# Altium schematic sheet Screen Driver.SchDoc: Graphics Driver PCB (part 2 of 3)
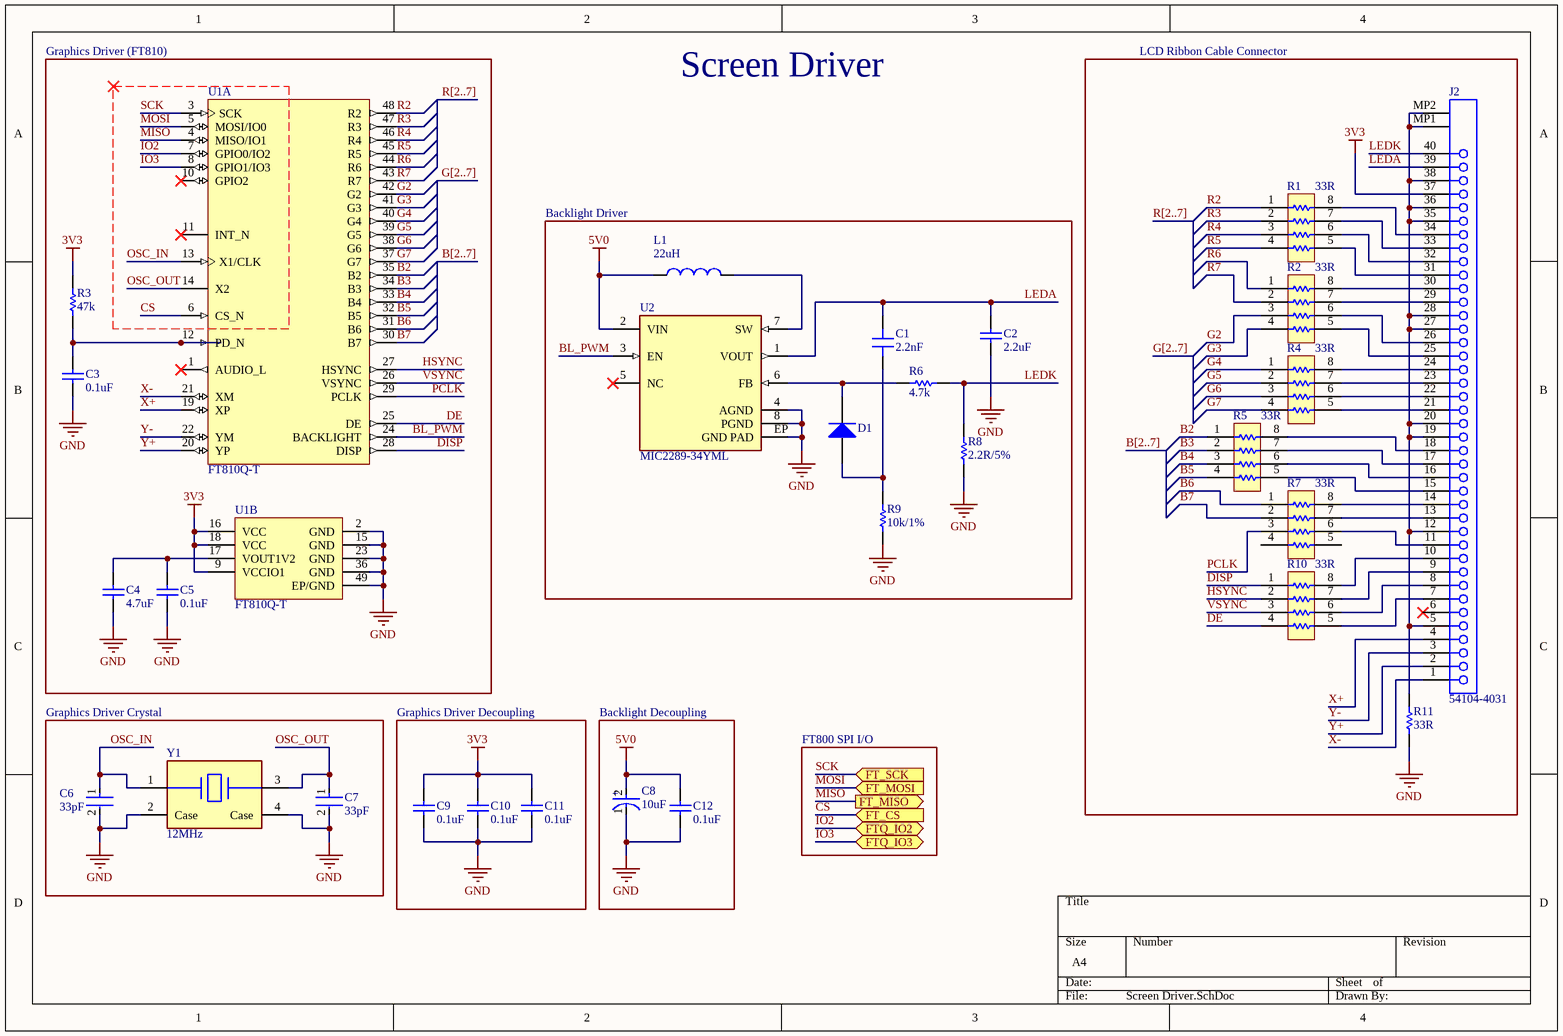
[diagram p1: Screen Driver.SchDoc]
## Library data of the parts
C1 = Capacitor - Ceramic: CAP CER 2200PF 50V X7R 0805; Manufacturer: Samsung; Manufacturer Part Number: CL21B222KBANNNC; Tolerance: 10%; Value: 2.2nF; Supplier 1: LCSC; Supplier Part Number 1: C1728; RoHS: Yes; Category: Ceramic Capacitors; Stock 1: 34350; Pricing 1: 50=0.01170, 500=0.00870, 1500=0.00810, 5000=0.00760, 25000=0.00730, 50000=0.00720, 50=0.01120, 500=0.00830, 1500=0.00770, 5000=0.00720, 25000=0.00700, 50000=0.00690, 50=0.05700, 500=0.04220, 1500=0.03940, 5000=0.03670, 25000=0.03550, 50000=0.03490, 50=0.05300, 500=0.03920, 1500=0.03670, 5000=0.03420, 25000=0.03300, 50000=0.03250, 50=0.00710, 500=0.00530, 1500=0.00490, 5000=0.00460, 25000=0.00440, 50000=0.00440, 50=0.00650, 500=0.00480, 1500=0.00450, 5000=0.00420, 25000=0.00410, 50000=0.00400, 50=0.06480, 500=0.04800, 1500=0.04490, 5000=0.04180, 25000=0.04040, 50000=0.03970, 50=0.88400, 500=0.65400, 1500=0.61170, 5000=0.56950, 25000=0.55080, 50000=0.54150, 50=0.03480, 500=0.02570, 1500=0.02410, 5000=0.02240, 25000=0.02170, 50000=0.02130, 50=0.65980, 500=0.48810, 1500=0.45660, 5000=0.42500, 25000=0.41110, 50000=0.40410, 50=0.07500, 500=0.05550, 1500=0.05190, 5000=0.04830, 25000=0.04670, 50000=0.04590, 50=0.01140, 500=0.00850, 1500=0.00790, 5000=0.00740, 25000=0.00710, 50000=0.00700, 50=0.00836, 500=0.00619, 1500=0.00579, 5000=0.00539, 25000=0.00521, 50000=0.00512 (AUD); Mount: Surface Mount; Case/Package: 0805; Case Code (Imperial): 0805; Case Code (Metric): 2012; Contact Plating: Tin; Material: Ceramic; Min Operating Temperature: -55°C; Max Operating Temperature: 125°C; Dielectric: X7R; Packaging: Tape and Reel; Capacitance: 2.2nF; Voltage Rating: 50V; Package Quantity: 1; Voltage: 50V; Length: 2mm; Height: 0.65mm; Depth: 1.25mm; Width: 0.049inch; Thickness: 0.03inch; Radiation Hardening: No; ComponentLink1URL: https://datasheet.ciiva.com/26838/getdatasheetpartid-640852-26838689.pdf?src-supplier=Verical; ComponentLink1Description: https://datasheet.ciiva.com/26838/getdatasheetpartid-640852-26838689.pdf?src-supplier=Verical; ComponentLink2URL: https://datasheet.ciiva.com/25802/cl21b222kbannnc-25802100.pdf?src-supplier=Digi-Key; ComponentLink2Description: https://datasheet.ciiva.com/25802/cl21b222kbannnc-25802100.pdf?src-supplier=Digi-Key; ComponentLink3URL: https://datasheet.ciiva.com/29199/455716-da-01-en-vs-kondensator-0805-29199282.pdf?src-supplier=Conrad; ComponentLink3Description: https://datasheet.ciiva.com/29199/455716-da-01-en-vs-kondensator-0805-29199282.pdf?src-supplier=Conrad; ComponentLink4URL: https://datasheet.ciiva.com/16199/cl05b104kq5nnnc-16199209.pdf?src-supplier=Future+Electronics; ComponentLink4Description: https://datasheet.ciiva.com/16199/cl05b104kq5nnnc-16199209.pdf?src-supplier=Future+Electronics; Supplier 2: Digi-Key; Supplier Part Number 2: 1276-1171-1-ND; Stock 2: 368698; Pricing 2: 1=0.10000, 10=0.04500, 50=0.02440, 100=0.01990, 500=0.01424, 1000=0.01119 (USD)
C2 = CMP-1662-00021-1: Chip Capacitor, 22 uF, +/- 10%, 25 V, -55 to 125 degC, 1210 (3225 Metric), RoHS, Tape and Reel; Manufacturer: Murata; Manufacturer Part Number: GRM32ER71E226KE15L; Current Rating: 3 A; Colour: Black; Gender: Male; Material: Ceramic; Capacitance: 22uF; Voltage Rating: 25V; Dielectric: X7R; Contact Plating: Gold; PackageDescription: 2-Pin Surface Mount Device, Body 3.2 x 2.5 mm; Package Quantity: 100; Height: 8.13 mm; Pins: 40; Mount: Through Hole; ComponentLink1URL: http://www.murata.com/; RoHSCompliant: True; Packaging: Tray; ComponentLink2URL: https://datasheet.ciiva.com/3776/2741grm32er71e226ke1523-3776996.pdf; Width: 2.34 mm; Radiation Hardening: No; Lead Pitch: 2.54 mm; Min Operating Temperature: -65degC; Contact Finish: Gold; REACH SVHC: Unknown; Max Operating Temperature: 105degC; DatasheetVersion: Aug-14; Length: 101.19 mm; Contact Material: Bronze; ComponentLink2Description: Datasheet; ComponentLink1Description: Manufacturer URL; PackageReference: 1210; Supplier 1: LCSC; Supplier Part Number 1: C21397; RoHS: Yes; Category: Ceramic Capacitors; Stock 1: 95358; Pricing 1: 1=0.29290, 10=0.21340, 30=0.19880, 100=0.18420, 500=0.17770, 1000=0.17450, 1=0.27960, 10=0.20380, 30=0.18980, 100=0.17590, 500=0.16970, 1000=0.16660, 1=1.42360, 10=1.03740, 30=0.96640, 100=0.89540, 500=0.86400, 1000=0.84830, 1=1.32480, 10=0.96540, 30=0.89940, 100=0.83330, 500=0.80400, 1000=0.78950, 1=0.17790, 10=0.12970, 30=0.12080, 100=0.11190, 500=0.10800, 1000=0.10600, 1=0.16240, 10=0.11840, 30=0.11030, 100=0.10220, 500=0.09860, 1000=0.09680, 1=1.61930, 10=1.18000, 30=1.09920, 100=1.01850, 500=0.98270, 1000=0.96490, 1=22.08220, 10=16.09130, 30=14.99040, 100=13.88950, 500=13.40150, 1000=13.15840, 1=0.86840, 10=0.63280, 30=0.58950, 100=0.54620, 500=0.52700, 1000=0.51750, 1=16.48090, 10=12.00970, 30=11.18800, 100=10.36640, 500=10.00220, 1000=9.82070, 1=1.87250, 10=1.36450, 30=1.27110, 100=1.17780, 500=1.13640, 1000=1.11580, 1=0.28580, 10=0.20830, 30=0.19400, 100=0.17980, 500=0.17340, 1000=0.17030, 1=0.20893, 10=0.15225, 30=0.14183, 100=0.13142, 500=0.12680, 1000=0.12450 (AUD); Case/Package: 1210; Number of Pins: 2; Case Code (Metric): 3225; Case Code (Imperial): 1210; Tolerance: 10%; Voltage Rating (DC): 25V; Termination: SMD/SMT; Voltage: 25V; Depth: 2.5mm; Thickness: 0.106inch; Lead Free: Lead Free; ComponentLink3URL: https://datasheet.ciiva.com/6072/1697714-6072768.pdf?src-supplier=Farnell; ComponentLink3Description: https://datasheet.ciiva.com/6072/1697714-6072768.pdf?src-supplier=Farnell; ComponentLink4URL: https://datasheet.ciiva.com/16497/product-16497009.pdf?src-supplier=Future+Electronics; ComponentLink4Description: https://datasheet.ciiva.com/16497/product-16497009.pdf?src-supplier=Future+Electronics; ComponentLink5URL: https://datasheet.ciiva.com/11789/0900766b80ef921d-11789129.pdf?src-supplier=RSComponents; ComponentLink5Description: https://datasheet.ciiva.com/11789/0900766b80ef921d-11789129.pdf?src-supplier=RSComponents; ComponentLink6URL: https://datasheet.ciiva.com/3776/2741grm32er71e226ke1523-3776996.pdf?src-supplier=Arrow+Electronics; ComponentLink6Description: https://datasheet.ciiva.com/3776/2741grm32er71e226ke1523-3776996.pdf?src-supplier=Arrow+Electronics; ComponentLink7URL: https://datasheet.ciiva.com/29201/451826-da-01-de-vs-kondens-grm32-er71e-226ke15l-29201795.pdf?src-supplier=Conrad; ComponentLink7Description: https://datasheet.ciiva.com/29201/451826-da-01-de-vs-kondens-grm32-er71e-226ke15l-29201795.pdf?src-supplier=Conrad; ComponentLink8URL: https://datasheet.ciiva.com/175/partnumbering-e-01-175746.pdf?src-supplier=Digi-Key; ComponentLink8Description: https://datasheet.ciiva.com/175/partnumbering-e-01-175746.pdf?src-supplier=Digi-Key; ComponentLink9URL: https://datasheet.ciiva.com/175/partnumbering-e-01-175747.pdf?src-supplier=Digi-Key; ComponentLink9Description: https://datasheet.ciiva.com/175/partnumbering-e-01-175747.pdf?src-supplier=Digi-Key; ComponentLink10URL: https://datasheet.ciiva.com/175/partnumbering-e-01-175748.pdf?src-supplier=Digi-Key; ComponentLink10Description: https://datasheet.ciiva.com/175/partnumbering-e-01-175748.pdf?src-supplier=Digi-Key; ComponentLink11URL: https://datasheet.ciiva.com/22703/1697714-22703397.pdf?src-supplier=Element14; ComponentLink11Description: https://datasheet.ciiva.com/22703/1697714-22703397.pdf?src-supplier=Element14; Supplier 2: Digi-Key; Supplier Part Number 2: 490-5313-1-ND; Stock 2: 200425; Pricing 2: 1=1.70000, 10=1.34400, 50=1.16520, 100=1.00830, 500=0.76184 (USD)
C3 C5 C9-C12 = CMP-2007-00279-1: Part Number: C0805C104K5RACTU; Manufacturer: Kemet; Dielectric Material: Ceramic; Capacitance: 100nF; Tolerance: 10%; Voltage Rating: 50V; Dielectric: X7R; Voltage: 500V; Supplier 1: LCSC; Supplier Part Number 1: C129690; Manufacturer Part Number: C0805C104K5RACTU; RoHS: Yes; Category: Ceramic Capacitors; Stock 1: 744050; Pricing 1: 50=0.02360, 500=0.01780, 1500=0.01680, 5000=0.01570, 25000=0.01530, 50000=0.01500, 50=0.02250, 500=0.01700, 1500=0.01600, 5000=0.01500, 25000=0.01460, 50000=0.01430, 50=0.11760, 500=0.08890, 1500=0.08370, 5000=0.07840, 25000=0.07610, 50000=0.07490, 50=0.10700, 500=0.08090, 1500=0.07610, 5000=0.07130, 25000=0.06920, 50000=0.06810, 50=0.01440, 500=0.01090, 1500=0.01020, 5000=0.00960, 25000=0.00930, 50000=0.00920, 50=0.01310, 500=0.00990, 1500=0.00930, 5000=0.00870, 25000=0.00850, 50000=0.00830, 50=0.13020, 500=0.09850, 1500=0.09270, 5000=0.08680, 25000=0.08420, 50000=0.08300, 50=1.77600, 500=1.34310, 1500=1.26360, 5000=1.18400, 25000=1.14870, 50000=1.13130, 50=0.07150, 500=0.05410, 1500=0.05090, 5000=0.04770, 25000=0.04620, 50000=0.04550, 50=1.20420, 500=0.91060, 1500=0.85670, 5000=0.80280, 25000=0.77880, 50000=0.76700, 50=0.14790, 500=0.11180, 1500=0.10520, 5000=0.09860, 25000=0.09570, 50000=0.09420, 50=0.02320, 500=0.01750, 1500=0.01650, 5000=0.01550, 25000=0.01500, 50000=0.01480, 50=0.01680, 500=0.01271, 1500=0.01196, 5000=0.01120, 25000=0.01087, 50000=0.01070 (AUD); Mount: Surface Mount,PCB; Case/Package: 0805; Number of Pins: 2; Case Code (Imperial): 0805; Case Code (Metric): 2012; Contact Plating: Tin,Matte; Min Operating Temperature: -55°C; Max Operating Temperature: 125°C; Packaging: Tape and Reel; Termination: SMD/SMT; Package Quantity: 4000; Voltage Rating (DC): 50V; Length: 2mm; Height: 0.9mm; Depth: 1.25mm; Width: 1.2mm; Thickness: 0.035inch; Lead Pitch: 0.75mm; Radiation Hardening: No; REACH SVHC: No SVHC; ComponentLink1URL: https://datasheet.ciiva.com/14589/70095383-14589048.pdf?src-supplier=Allied+Electronics; ComponentLink1Description: https://datasheet.ciiva.com/14589/70095383-14589048.pdf?src-supplier=Allied+Electronics; ComponentLink2URL: https://datasheet.ciiva.com/28682/1851736-28682232.pdf?src-supplier=Element14; ComponentLink2Description: https://datasheet.ciiva.com/28682/1851736-28682232.pdf?src-supplier=Element14; ComponentLink3URL: https://datasheet.ciiva.com/32431/slceramic-chip-condensers-e-32431755.pdf?src-supplier=Distrelec; ComponentLink3Description: https://datasheet.ciiva.com/32431/slceramic-chip-condensers-e-32431755.pdf?src-supplier=Distrelec; ComponentLink4URL: https://datasheet.ciiva.com/18410/70095383-18410815.pdf?src-supplier=Allied+Electronics; ComponentLink4Description: https://datasheet.ciiva.com/18410/70095383-18410815.pdf?src-supplier=Allied+Electronics; Supplier 2: Digi-Key; Supplier Part Number 2: 399-1170-1-ND; Stock 2: 2736847; Pricing 2: 1=0.16000, 10=0.11500, 50=0.06540, 100=0.05420, 500=0.03802, 1000=0.03147 (USD)
C4 = CMP-2007-04034-1: Part Number: TAJR475K006RNJ; Manufacturer: AVX Interconnect / Elco; Dielectric Material: Tantalum; Tolerance: 10%; Voltage Rating: 6.3V; Dissipation Factor: 6%; ESR (Equivalent Series Resistance): 7R; Leakage Current: 500nA; Polarity: Polar; Supplier 1: LCSC; Supplier Part Number 1: C308815; Manufacturer Part Number: TAJR475K006RNJ; RoHS: Yes; Category: Tantalum Capacitors; Stock 1: 4388; Pricing 1: 1=0.18530, 10=0.13710, 30=0.12820, 100=0.11930, 500=0.11540, 1000=0.11340, 1=0.17690, 10=0.13090, 30=0.12240, 100=0.11390, 500=0.11020, 1000=0.10830, 1=0.90070, 10=0.66620, 30=0.62320, 100=0.58010, 500=0.56100, 1000=0.55140, 1=0.83830, 10=0.62000, 30=0.58000, 100=0.53980, 500=0.52210, 1000=0.51320, 1=0.11260, 10=0.08330, 30=0.07790, 100=0.07250, 500=0.07010, 1000=0.06890, 1=0.10280, 10=0.07600, 30=0.07110, 100=0.06620, 500=0.06400, 1000=0.06290, 1=1.02460, 10=0.75780, 30=0.70890, 100=0.65980, 500=0.63810, 1000=0.62730, 1=13.97220, 10=10.33470, 30=9.66720, 100=8.99770, 500=8.70180, 1000=8.55380, 1=0.54950, 10=0.40640, 30=0.38020, 100=0.35390, 500=0.34220, 1000=0.33640, 1=10.42810, 10=7.71330, 30=7.21500, 100=6.71540, 500=6.49450, 1000=6.38410, 1=1.18480, 10=0.87640, 30=0.81980, 100=0.76300, 500=0.73790, 1000=0.72530, 1=0.18080, 10=0.13380, 30=0.12510, 100=0.11650, 500=0.11260, 1000=0.11070, 1=0.13220, 10=0.09778, 30=0.09147, 100=0.08513, 500=0.08233, 1000=0.08093 (AUD); Mount: Surface Mount; Case/Package: 0805; Number of Pins: 2; Weight: 0.000194oz; Case Code (Metric): 2012; Case Code (Imperial): 0805; Min Operating Temperature: -55°C; Max Operating Temperature: 125°C; Capacitance: 4.7uF; Packaging: Tape and Reel; Voltage Rating (DC): 6.3V; Package Quantity: 1; Termination: SMD/SMT; Voltage: 6.3V; Features: General Purpose; Length: 2.05mm; Height: 1.2mm; Depth: 1.3mm; Width: 0.051inch; Height - Seated (Max): 0.047inch; Radiation Hardening: No; REACH SVHC: No SVHC; Lead Free: Lead Free; ComponentLink1URL: https://datasheet.ciiva.com/267/taj-low-profile-267817.pdf?src-supplier=Digi-Key; ComponentLink1Description: https://datasheet.ciiva.com/267/taj-low-profile-267817.pdf?src-supplier=Digi-Key; Supplier 2: Digi-Key; Supplier Part Number 2: 478-3272-1-ND; Stock 2: 19434; Pricing 2: 1=0.85000, 10=0.64400, 50=0.53460, 100=0.46040, 500=0.35640, 1000=0.30690 (USD)
C6 C7 = CMP-13271-001759-1: CL21 Series 0805 33pF 50V ±5% Tolerance C0G Multilayer Ceramic Chip Capacitor; Manufacturer: Samsung; Manufacturer Part Number: CL21C330JBANNNC; Temperature Coefficient: 300ppm/°C; Packaging: Tape and Reel; Case/Package: 0805; Depth: 1.25mm; Case Code (Metric): 2012; Min Operating Temperature: -55°C; Lead Free: Lead Free; Width: 0.049inch; Case Code (Imperial): 0805; Max Operating Temperature: 125°C; Mount: Surface Mount; Dielectric: C0G; Length: 2mm; Height: 0.65mm; Thickness: 0.03inch; Voltage Rating: 50V; Capacitance: 33pF; Material: Ceramic; Tolerance: 5%; Voltage: 50V; Voltage Rating (DC): 50V; Radiation Hardening: No; Package Quantity: 1; Supplier 1: LCSC; Supplier Part Number 1: C1814; RoHS: Yes; Category: Ceramic Capacitors; Stock 1: 48100; Pricing 1: 50=0.01420, 500=0.01030, 1500=0.00960, 5000=0.00890, 25000=0.00860, 50000=0.00840, 50=0.01370, 500=0.00990, 1500=0.00920, 5000=0.00850, 25000=0.00820, 50000=0.00810, 50=0.07090, 500=0.05140, 1500=0.04780, 5000=0.04430, 25000=0.04270, 50000=0.04190, 50=0.06510, 500=0.04720, 1500=0.04400, 5000=0.04070, 25000=0.03920, 50000=0.03850, 50=0.00880, 500=0.00630, 1500=0.00590, 5000=0.00550, 25000=0.00530, 50000=0.00520, 50=0.00810, 500=0.00590, 1500=0.00550, 5000=0.00510, 25000=0.00490, 50000=0.00480, 50=0.08040, 500=0.05830, 1500=0.05430, 5000=0.05020, 25000=0.04840, 50000=0.04750, 50=1.10080, 500=0.79860, 1500=0.74310, 5000=0.68760, 25000=0.66280, 50000=0.65060, 50=0.04310, 500=0.03120, 1500=0.02910, 5000=0.02690, 25000=0.02590, 50000=0.02550, 50=0.77670, 500=0.56340, 1500=0.52430, 5000=0.48510, 25000=0.46760, 50000=0.45900, 50=0.09090, 500=0.06590, 1500=0.06130, 5000=0.05680, 25000=0.05470, 50000=0.05370, 50=0.01420, 500=0.01030, 1500=0.00960, 5000=0.00890, 25000=0.00850, 50000=0.00840, 50=0.01037, 500=0.00752, 1500=0.00700, 5000=0.00648, 25000=0.00624, 50000=0.00613 (AUD); ComponentLink1URL: https://datasheet.ciiva.com/15195/getdatasheetpartid-357464-15195955.pdf?src-supplier=Verical; ComponentLink1Description: https://datasheet.ciiva.com/15195/getdatasheetpartid-357464-15195955.pdf?src-supplier=Verical; ComponentLink2URL: https://datasheet.ciiva.com/29199/454515-da-01-en-vs-kondensator-0805-29199594.pdf?src-supplier=Conrad; ComponentLink2Description: https://datasheet.ciiva.com/29199/454515-da-01-en-vs-kondensator-0805-29199594.pdf?src-supplier=Conrad; Supplier 2: Digi-Key; Supplier Part Number 2: 1276-1105-1-ND; Stock 2: 169380; Pricing 2: 1=0.10000, 10=0.05100, 50=0.02760, 100=0.02260, 500=0.01614, 1000=0.01267 (USD)
C8 = CMP-03017-000001-1: CAP TANT 10UF 10% 25V 2312; Manufacturer Part Number: T491C106K025AT; Manufacturer: Kemet; Material: Tantalum; Standoff Height: 0mm; Life: 2000Hours; Dissipation Factor: 6%; Esr: 1.5Ω; Ripple Current: 271mA; Leakage Current: 2.5uA; ESR (Equivalent Series Resistance): 1.5R; Polarity: Polar; Life (Hours): 2000Hour; Digikey Description: CAP TANT 10UF 10% 25V 2312; Voltage Rating: 25V; Device Class L3: Tantalum Capacitors; ComponentLink2Description: Datasheet; Tolerance: 10%; Device Class L2: Capacitors; Temperature: -55°C to +125°C; Octopart: https://octopart.com/t491c106k025at-kemet-126002; Automotive: No; Height: 2.8mm; Package: T491C; Temperature Range Low: -55°C; Lead Free: Yes; Capacitance: 10uF; Category: Cap; Mouser Description: Tantalum Capacitors - Solid SMD 25V 10uF 10% C; Temperature Range High: +125°C; Value: 10uF; Device Class L1: Passive Components; ComponentLink2URL: https://content.kemet.com/datasheets/KEM_T2005_T491.pdf; RoHS: TRUE; Supplier 1: LCSC; Supplier Part Number 1: C116748; Stock 1: 623; Pricing 1: 1=0.31700, 10=0.23930, 30=0.22500, 100=0.21070, 500=0.20440, 1000=0.20130, 1=0.29970, 10=0.22620, 30=0.21270, 100=0.19920, 500=0.19320, 1000=0.19020, 1=1.52640, 10=1.15200, 30=1.08330, 100=1.01450, 500=0.98400, 1000=0.96900, 1=1.42850, 10=1.07820, 30=1.01380, 100=0.94950, 500=0.92090, 1000=0.90680, 1=0.19190, 10=0.14490, 30=0.13620, 100=0.12760, 500=0.12370, 1000=0.12180, 1=0.17590, 10=0.13280, 30=0.12490, 100=0.11690, 500=0.11340, 1000=0.11170, 1=1.73490, 10=1.30940, 30=1.23120, 100=1.15310, 500=1.11830, 1000=1.10130, 1=23.60010, 10=17.81210, 30=16.74900, 100=15.68590, 500=15.21330, 1000=14.98130, 1=0.93360, 10=0.70460, 30=0.66260, 100=0.62050, 500=0.60180, 1000=0.59260, 1=17.19740, 10=12.97970, 30=12.20510, 100=11.43040, 500=11.08600, 1000=10.91690, 1=2.01820, 10=1.52330, 30=1.43240, 100=1.34140, 500=1.30100, 1000=1.28120, 1=0.30740, 10=0.23200, 30=0.21810, 100=0.20430, 500=0.19810, 1000=0.19510, 1=0.22385, 10=0.16895, 30=0.15887, 100=0.14878, 500=0.14430, 1000=0.14210 (AUD); Mount: Surface Mount,PCB; Case/Package: Molded; Number of Pins: 2; Case Code (Imperial): 2412; Case Code (Metric): 6032; Dielectric Material: Tantalum; Min Operating Temperature: -55°C; Max Operating Temperature: 125°C; Package Quantity: 1; Packaging: Tape and Reel; Voltage Rating (DC): 25V; Termination: SMD/SMT; Voltage: 25V; Features: General Purpose; Length: 6mm; Width: 3.2mm; Depth: 3.2mm; Height - Seated (Max): 0.11inch; Radiation Hardening: No; REACH SVHC: No SVHC; ComponentLink1URL: https://datasheet.ciiva.com/23876/1732750-23876722.pdf?src-supplier=Newark; ComponentLink1Description: https://datasheet.ciiva.com/23876/1732750-23876722.pdf?src-supplier=Newark; ComponentLink3URL: https://datasheet.ciiva.com/11793/0900766b80718482-11793044.pdf?src-supplier=RSComponents; ComponentLink3Description: https://datasheet.ciiva.com/11793/0900766b80718482-11793044.pdf?src-supplier=RSComponents; ComponentLink4URL: https://datasheet.ciiva.com/258/kem-t2005-t491-258374.pdf?src-supplier=Digi-Key; ComponentLink4Description: https://datasheet.ciiva.com/258/kem-t2005-t491-258374.pdf?src-supplier=Digi-Key; ComponentLink5URL: https://datasheet.ciiva.com/20171/458351-da-en-01-20171926.pdf?src-supplier=Rapid+Electronics; ComponentLink5Description: https://datasheet.ciiva.com/20171/458351-da-en-01-20171926.pdf?src-supplier=Rapid+Electronics; ComponentLink6URL: https://datasheet.ciiva.com/34302/1573804-34302524.pdf?src-supplier=Jameco; ComponentLink6Description: https://datasheet.ciiva.com/34302/1573804-34302524.pdf?src-supplier=Jameco; ComponentLink7URL: https://datasheet.ciiva.com/26341/458351-da-01-en-kondensator-10uf-6032-10pr-25v-85c-26341615.pdf?src-supplier=Conrad; ComponentLink7Description: https://datasheet.ciiva.com/26341/458351-da-01-en-kondensator-10uf-6032-10pr-25v-85c-26341615.pdf?src-supplier=Conrad; ComponentLink8URL: https://datasheet.ciiva.com/258/kem-t2005-t491-258375.pdf?src-supplier=Digi-Key; ComponentLink8Description: https://datasheet.ciiva.com/258/kem-t2005-t491-258375.pdf?src-supplier=Digi-Key; ComponentLink9URL: https://datasheet.ciiva.com/258/kem-t2005-t491-258376.pdf?src-supplier=Digi-Key; ComponentLink9Description: https://datasheet.ciiva.com/258/kem-t2005-t491-258376.pdf?src-supplier=Digi-Key; ComponentLink10URL: https://datasheet.ciiva.com/14593/70095774-14593130.pdf?src-supplier=Allied+Electronics; ComponentLink10Description: https://datasheet.ciiva.com/14593/70095774-14593130.pdf?src-supplier=Allied+Electronics; ComponentLink11URL: https://datasheet.ciiva.com/7758/1732750-7758925.pdf?src-supplier=Element14; ComponentLink11Description: https://datasheet.ciiva.com/7758/1732750-7758925.pdf?src-supplier=Element14; ComponentLink12URL: https://datasheet.ciiva.com/7758/1698764-7758926.pdf?src-supplier=Element14; ComponentLink12Description: https://datasheet.ciiva.com/7758/1698764-7758926.pdf?src-supplier=Element14; ComponentLink13URL: https://datasheet.ciiva.com/41657/1854511-41657326.pdf?src-supplier=Farnell; ComponentLink13Description: https://datasheet.ciiva.com/41657/1854511-41657326.pdf?src-supplier=Farnell; ComponentLink14URL: https://datasheet.ciiva.com/7758/1732750-7758927.pdf?src-supplier=Element14; ComponentLink14Description: https://datasheet.ciiva.com/7758/1732750-7758927.pdf?src-supplier=Element14; Supplier 2: Digi-Key; Supplier Part Number 2: 399-3734-1-ND; Stock 2: 89543; Pricing 2: 1=0.57000, 10=0.40300, 50=0.30500, 100=0.26570 (USD)
D1 = CMP-1667-00004-1: Fast Switching Diode, 75 V, 0.3 A, -65 to 150 degC, 2-Pin SOD323, RoHS, Tape and Reel; Manufacturer: Diodes; Reverse Recovery Time: 4ns; Forward Current: 300mA; Max Repetitive Reverse Voltage (Vrrm): 75V; Element Configuration: Single; Forward Voltage: 1.25V; Peak Non-Repetitive Surge Current: 2A; Average Rectified Current: 150mA; Max Reverse Current: 1uA; Power Dissipation: 200mW; Capacitance: 2pF; Polarity: Standard; DatasheetVersion: Rev. 25-2, 03/2016; PackageDescription: 2-Pin Small Outline Diode, Body 1.7 x 1.3 mm; ComponentLink2Description: Datasheet; ComponentLink1URL: http://www.diodes.com/; PackageReference: SOD323-2; ComponentLink2URL: http://www.diodes.com/datasheets/ds30097.pdf; ComponentLink1Description: Manufacturer URL; Supplier 1: LCSC; Supplier Part Number 1: C60580; Manufacturer Part Number: 1N4148WS-7-F; RoHS: Yes; Category: Rectifier Diodes; Stock 1: 1070150; Pricing 1: 50=0.01770, 500=0.01280, 1500=0.01190, 5000=0.01100, 25000=0.01040, 50000=0.01030, 50=0.01700, 500=0.01230, 1500=0.01140, 5000=0.01060, 25000=0.01000, 50000=0.00990, 50=0.08820, 500=0.06370, 1500=0.05930, 5000=0.05490, 25000=0.05190, 50000=0.05140, 50=0.08100, 500=0.05850, 1500=0.05450, 5000=0.05040, 25000=0.04770, 50000=0.04730, 50=0.01090, 500=0.00790, 1500=0.00730, 5000=0.00680, 25000=0.00640, 50000=0.00640, 50=0.01010, 500=0.00730, 1500=0.00680, 5000=0.00630, 25000=0.00590, 50000=0.00590, 50=0.10000, 500=0.07220, 1500=0.06720, 5000=0.06220, 25000=0.05890, 50000=0.05830, 50=1.36960, 500=0.98920, 1500=0.92070, 5000=0.85220, 25000=0.80660, 50000=0.79890, 50=0.05360, 500=0.03870, 1500=0.03600, 5000=0.03330, 25000=0.03160, 50000=0.03130, 50=0.96630, 500=0.69790, 1500=0.64960, 5000=0.60130, 25000=0.56910, 50000=0.56370, 50=0.11310, 500=0.08170, 1500=0.07600, 5000=0.07040, 25000=0.06660, 50000=0.06600, 50=0.01760, 500=0.01270, 1500=0.01190, 5000=0.01100, 25000=0.01040, 50000=0.01030, 50=0.01290, 500=0.00932, 1500=0.00867, 5000=0.00803, 25000=0.00760, 50000=0.00753 (AUD); Mount: Surface Mount; Number of Pins: 2; Weight: 0.000173oz; Contact Plating: Tin,Matte; Min Operating Temperature: -65°C; Max Operating Temperature: 150°C; Packaging: Tape and Reel; Package Quantity: 3000; Max Reverse Voltage (DC): 75V; Recovery Time: 4ns; Max Surge Current: 2A; Max Forward Surge Current (Ifsm): 2A; Current Rating: 150mA; Voltage Rating (DC): 75V; Power Rating: 200mW; Output Current: 150mA; Voltage: 75V; Length: 1.8mm; Height: 1mm; Width: 1.4mm; Radiation Hardening: No; Lead Free: Lead Free; REACH SVHC: No SVHC; ComponentLink3URL: https://datasheet.ciiva.com/16199/ds30097-16199061.pdf?src-supplier=Future+Electronics; ComponentLink3Description: https://datasheet.ciiva.com/16199/ds30097-16199061.pdf?src-supplier=Future+Electronics; ComponentLink4URL: https://datasheet.ciiva.com/1179/ds30097-1179355.pdf?src-supplier=Element14; ComponentLink4Description: https://datasheet.ciiva.com/1179/ds30097-1179355.pdf?src-supplier=Element14; ComponentLink5URL: https://datasheet.ciiva.com/8300/ds30097-8300396.pdf?src-supplier=Avnet; ComponentLink5Description: https://datasheet.ciiva.com/8300/ds30097-8300396.pdf?src-supplier=Avnet; ComponentLink6URL: https://datasheet.ciiva.com/911/ds30097-911741.pdf?src-supplier=Digi-Key; ComponentLink6Description: https://datasheet.ciiva.com/911/ds30097-911741.pdf?src-supplier=Digi-Key; ComponentLink7URL: https://datasheet.ciiva.com/911/ds30097-911743.pdf?src-supplier=Digi-Key; ComponentLink7Description: https://datasheet.ciiva.com/911/ds30097-911743.pdf?src-supplier=Digi-Key; ComponentLink8URL: https://datasheet.ciiva.com/16472/ds30097-16472599.pdf?src-supplier=Avnet+Asia; ComponentLink8Description: https://datasheet.ciiva.com/16472/ds30097-16472599.pdf?src-supplier=Avnet+Asia; ComponentLink9URL: https://datasheet.ciiva.com/911/ds30097-911742.pdf?src-supplier=Digi-Key; ComponentLink9Description: https://datasheet.ciiva.com/911/ds30097-911742.pdf?src-supplier=Digi-Key; ComponentLink10URL: https://datasheet.ciiva.com/25946/ds30097-25946926.pdf?src-supplier=Avnet+Europe; ComponentLink10Description: https://datasheet.ciiva.com/25946/ds30097-25946926.pdf?src-supplier=Avnet+Europe; Supplier 2: Digi-Key; Supplier Part Number 2: 1N4148WS-FDICT-ND; Stock 2: 630892; Pricing 2: 1=0.17000, 10=0.14500, 100=0.06860, 500=0.04068, 1000=0.02731 (USD)
J2 = CMP-1241-00508-1: 0.5 mm Pitch Easy-On(TM) Type FPC Connector, 2.0 mm Mated Height, Right Angle, ZIF, SMT, Top Contact, 40 Circuits, -20 to 85 degC, ELV and RoHS Compliant, Tape and Reel; Manufacturer: Molex; PCB Retention: Yes; Current (Max per Contact): 0.5A; Stackable: No; Durability (mating cycles max): 20; Pitch - Mating Interface: 0.50mm; Circuits (Loaded): 40; Mated Height: 2.00mm; Entry Angle: 90degrees Angle; Material - Metal: Phosphor Bronze; Voltage (Max): 50V; Actuator Material: Glass,Polyphenylene; Contact Resistance: 20mR; Current Rating: 500mA; Wire/Cable Type: Straight; Pitch: 0.5mm; ComponentLink3URL: http://www.molex.com/pdm_docs/sd/541044031_sd.pdf; ComponentLink2URL: http://www.molex.com/webdocs/datasheets/pdf/en-us/0541044031_FFC_FPC_CONNECTORS.pdf; Number of Rows: 1; ComponentLink1Description: Manufacturer URL; ComponentLink2Description: Datasheet; Mounting Technology: Surface Mount; ComponentLink1URL: http://www.molex.com/molex/index.jsp; RoHS: TRUE; PackageReference: 54104-4031; Polarized to PCB: Yes; ComponentLink3Description: Package Specification; PackageVersion: Rev. F, 06/2012; PackageDescription: 40-Lead FPC Connector, Pitch 0.5 mm; Contact Position: Top; PCB Locator: No; PartNumber: 54104-4031; Orientation: Right Angle; Packing: Tape and Reel; Supplier 1: LCSC; Supplier Part Number 1: C164172; Manufacturer Part Number: 54104-4031; Category: FFC / FPC; Stock 1: 128; Pricing 1: 1=1.36830, 10=1.00220, 30=0.93360, 100=0.86720, 500=0.83520, 1000=0.82140, 1=1.31350, 10=0.96200, 30=0.89610, 100=0.83240, 500=0.80170, 1000=0.78850, 1=6.81160, 10=4.98910, 30=4.64740, 100=4.31710, 500=4.15760, 1000=4.08920, 1=6.25900, 10=4.58440, 30=4.27040, 100=3.96680, 500=3.82030, 1000=3.75750, 1=0.84120, 10=0.61620, 30=0.57400, 100=0.53320, 500=0.51350, 1000=0.50500, 1=0.77900, 10=0.57050, 30=0.53150, 100=0.49370, 500=0.47540, 1000=0.46760, 1=7.72440, 10=5.65770, 30=5.27020, 100=4.89560, 500=4.71480, 1000=4.63720, 1=105.80120, 10=77.49320, 30=72.18540, 100=67.05460, 500=64.57760, 1000=63.51610, 1=4.13970, 10=3.03210, 30=2.82440, 100=2.62360, 500=2.52670, 1000=2.48520, 1=74.64540, 10=54.67340, 30=50.92860, 100=47.30870, 500=45.56110, 1000=44.81220, 1=8.73420, 10=6.39730, 30=5.95910, 100=5.53560, 500=5.33110, 1000=5.24350, 1=1.36340, 10=0.99860, 30=0.93020, 100=0.86410, 500=0.83220, 1000=0.81850, 1=0.99667, 10=0.73000, 30=0.68000, 100=0.63167, 500=0.60833, 1000=0.59833 (AUD); Mount: Surface Mount; Contact Material: Bronze; Contact Plating: Gold; Housing Color: Natural; Housing Material: Nylon; Min Operating Temperature: -20°C; Max Operating Temperature: 85°C; Packaging: Tape and Reel; Termination: Solder; Voltage Rating: 50V; Package Quantity: 1500; Number of Positions: 40; Mating Cycles: 20; Length: 25.5mm; Depth: 5.6mm; Radiation Hardening: No; Flammability Rating: UL94 V-0; ComponentLink4URL: https://datasheet.ciiva.com/671/541045031-sd-671622.pdf?src-supplier=Digi-Key; ComponentLink4Description: https://datasheet.ciiva.com/671/541045031-sd-671622.pdf?src-supplier=Digi-Key; ComponentLink5URL: https://datasheet.ciiva.com/16468/0541044031-ffc-fpc-connectors-16468800.pdf?src-supplier=Avnet+Asia; ComponentLink5Description: https://datasheet.ciiva.com/16468/0541044031-ffc-fpc-connectors-16468800.pdf?src-supplier=Avnet+Asia; ComponentLink6URL: https://datasheet.ciiva.com/26934/getdatasheetpartid-757648-26934644.pdf?src-supplier=Verical; ComponentLink6Description: https://datasheet.ciiva.com/26934/getdatasheetpartid-757648-26934644.pdf?src-supplier=Verical; ComponentLink7URL: https://datasheet.ciiva.com/25291/1597087-25291974.pdf?src-supplier=Newark; ComponentLink7Description: https://datasheet.ciiva.com/25291/1597087-25291974.pdf?src-supplier=Newark; ComponentLink8URL: https://datasheet.ciiva.com/11745/0900766b80d5c350-11745166.pdf?src-supplier=RSComponents; ComponentLink8Description: https://datasheet.ciiva.com/11745/0900766b80d5c350-11745166.pdf?src-supplier=RSComponents; ComponentLink9URL: https://datasheet.ciiva.com/10366/0541044031-ffc-fpc-connectors-10366824.pdf?src-supplier=Avnet; ComponentLink9Description: https://datasheet.ciiva.com/10366/0541044031-ffc-fpc-connectors-10366824.pdf?src-supplier=Avnet; ComponentLink10URL: https://datasheet.ciiva.com/672/541044031-sd-672267.pdf?src-supplier=Digi-Key; ComponentLink10Description: https://datasheet.ciiva.com/672/541044031-sd-672267.pdf?src-supplier=Digi-Key; ComponentLink11URL: https://datasheet.ciiva.com/672/541044031-sd-672268.pdf?src-supplier=Digi-Key; ComponentLink11Description: https://datasheet.ciiva.com/672/541044031-sd-672268.pdf?src-supplier=Digi-Key; Supplier 2: Digi-Key; Supplier Part Number 2: WM3431CT-ND; Stock 2: 4791; Pricing 2: 1=2.94000, 10=2.82100, 25=2.58560, 50=2.46800, 100=2.35050, 250=2.05668, 500=1.99790 (USD)
L1 = CB2012T220K: POWER INDUCTOR, 22UH, 0.135A, 10%, 16MHz; Manufacturer: Taiyo Yuden; Core Material: Ferrite; DC Resistance (DCR): 2.21R; Max DC Current: 135mA; Shielding: Unshielded; Test Frequency: 2.52MHz; Current Rating: 280mA; SnapEDA_Link: https://www.snapeda.com/parts/CB2012T220K/Taiyo%20Yuden/view-part/1505221/?ref=snap; Check_prices: https://www.snapeda.com/parts/CB2012T220K/Taiyo%20Yuden/view-part/1505221/?ref=eda; Value: *; Supplier 1: LCSC; Supplier Part Number 1: C223175; Manufacturer Part Number: CB2012T220K; RoHS: Yes; Category: Fixed Inductors; Stock 1: 3335; Pricing 1: 5=0.14230, 50=0.10430, 150=0.09730, 500=0.09030, 2500=0.08720, 5000=0.08570, 5=0.13570, 50=0.09940, 150=0.09280, 500=0.08610, 2500=0.08320, 5000=0.08170, 5=0.69220, 50=0.50730, 150=0.47330, 500=0.43930, 2500=0.42420, 5000=0.41680, 5=0.64750, 50=0.47450, 150=0.44270, 500=0.41090, 2500=0.39680, 5000=0.38980, 5=0.08700, 50=0.06380, 150=0.05950, 500=0.05520, 2500=0.05330, 5000=0.05240, 5=0.07880, 50=0.05780, 150=0.05390, 500=0.05000, 2500=0.04830, 5000=0.04740, 5=0.79000, 50=0.57890, 150=0.54010, 500=0.50140, 2500=0.48410, 5000=0.47560, 5=10.73740, 50=7.86820, 150=7.34120, 500=6.81420, 2500=6.58000, 5000=6.46430, 5=0.42450, 50=0.31110, 150=0.29020, 500=0.26940, 2500=0.26010, 5000=0.25560, 5=7.97060, 50=5.84080, 150=5.44960, 500=5.05840, 2500=4.88450, 5000=4.79860, 5=0.91050, 50=0.66720, 150=0.62250, 500=0.57780, 2500=0.55800, 5000=0.54820, 5=0.13900, 50=0.10190, 150=0.09510, 500=0.08820, 2500=0.08520, 5000=0.08370, 5=0.10194, 50=0.07470, 150=0.06969, 500=0.06469, 2500=0.06247, 5000=0.06137 (AUD); Mount: Surface Mount; Case/Package: 0805; Number of Pins: 2; Case Code (Imperial): 0805; Case Code (Metric): 2012; Min Operating Temperature: -40°C; Max Operating Temperature: 105°C; Tolerance: 10%; Inductance: 22uH; Packaging: Tape and Reel; Package Quantity: 3000; Self Resonant Frequency: 16MHz; Termination: SMD/SMT; Resistor Type: Wirewound; Saturation Current: 135mA; Length: 0.079inch; Height: 0.9mm; Width: 1.25mm; Height - Seated (Max): 0.057inch; Depth: 1.45mm; Radiation Hardening: No; Lead Free: Lead Free; Halogen Free: Halogen Free; ComponentLink1URL: https://datasheet.ciiva.com/8499/cb2012t220k-ss-8499608.pdf?src-supplier=Avnet; ComponentLink1Description: https://datasheet.ciiva.com/8499/cb2012t220k-ss-8499608.pdf?src-supplier=Avnet; ComponentLink2URL: https://datasheet.ciiva.com/1040/cb2012t220k-ss-1040378.pdf?src-supplier=Digi-Key; ComponentLink2Description: https://datasheet.ciiva.com/1040/cb2012t220k-ss-1040378.pdf?src-supplier=Digi-Key; Supplier 2: Digi-Key; Supplier Part Number 2: 587-2455-1-ND; Stock 2: 2355; Pricing 2: 1=0.23000, 10=0.20300, 25=0.18000, 50=0.15300, 100=0.13500, 250=0.12376, 500=0.11250, 1000=0.09450 (USD)
R1 R2 R4 R5 R7 R10 = CMP-2000-05314-1: Chip Resistor, 10 KOhm, +/- 5%, -55 to 125degC, 8-Pin SMD (4 X 0603), RoHS, Tape and Reel; Manufacturer: Panasonic; Manufacturer Part Number: EXB-38V103JV; Resistance: 10kO; No of Elements: 4; Power Dissipation: 0.063W; Circuit Type: Isolated; Power Per Element: 62.5mW; Temperature Coefficient: 200ppm/°C; Voltage Rating: 50V; Voltage Rating (DC): 100V; Number of Contacts: 8; Datasheet Version: Feb-14; Manufacturer URL: http://www.panasonic.com/; Datasheet URL: https://datasheet.ciiva.com/26913/getdatasheetpartid-253144-26913770.pdf; Tolerance (%): ±5%; Size Code: 0603; Supplier 1: LCSC; Supplier Part Number 1: C192513; RoHS: Yes; Category: Resistor Arrays; Stock 1: 4160; Pricing 1: 20=0.02520, 200=0.01850, 600=0.01730, 2000=0.01610, 10000=0.01550, 20000=0.01530, 20=0.02400, 200=0.01770, 600=0.01650, 2000=0.01530, 10000=0.01480, 20000=0.01460, 20=0.12230, 200=0.09000, 600=0.08400, 2000=0.07810, 10000=0.07540, 20000=0.07410, 20=0.11380, 200=0.08370, 600=0.07820, 2000=0.07270, 10000=0.07020, 20000=0.06900, 20=0.01530, 200=0.01120, 600=0.01050, 2000=0.00980, 10000=0.00940, 20000=0.00930, 20=0.01400, 200=0.01030, 600=0.00960, 2000=0.00890, 10000=0.00860, 20000=0.00850, 20=0.13910, 200=0.10230, 600=0.09560, 2000=0.08880, 10000=0.08580, 20000=0.08430, 20=1.89720, 200=1.39540, 600=1.30330, 2000=1.21110, 10000=1.17020, 20000=1.14990, 20=0.07460, 200=0.05490, 600=0.05130, 2000=0.04760, 10000=0.04600, 20000=0.04520, 20=1.41600, 200=1.04150, 600=0.97270, 2000=0.90390, 10000=0.87340, 20000=0.85820, 20=0.16090, 200=0.11830, 600=0.11050, 2000=0.10270, 10000=0.09920, 20000=0.09750, 20=0.02460, 200=0.01810, 600=0.01690, 2000=0.01570, 10000=0.01510, 20000=0.01490, 20=0.01795, 200=0.01320, 600=0.01233, 2000=0.01146, 10000=0.01107, 20000=0.01088 (AUD); Mount: Surface Mount; Case/Package: 1206; Number of Pins: 8; Number of Terminals: 8; Case Code (Metric): 3216; Case Code (Imperial): 1206; Contact Plating: Tin; Min Operating Temperature: -55°C; Max Operating Temperature: 125°C; Tolerance: 5%; Packaging: Tape and Reel; Number of Resistors: 4; Package Quantity: 1; Termination: Convex; Number of Elements: 4; Length: 3.2mm; Height: 0.5mm; Width: 1.6mm; Terminal Pitch: 0.8mm; Depth: 1.6mm; Radiation Hardening: No; Military Standard: Not; REACH SVHC: Unknown; Lead Free: Lead Free; ComponentLink1URL: https://datasheet.ciiva.com/26913/getdatasheetpartid-253144-26913770.pdf?src-supplier=Verical; ComponentLink1Description: https://datasheet.ciiva.com/26913/getdatasheetpartid-253144-26913770.pdf?src-supplier=Verical; ComponentLink2URL: https://datasheet.ciiva.com/46387/1480003-46387993.pdf?src-supplier=Element14; ComponentLink2Description: https://datasheet.ciiva.com/46387/1480003-46387993.pdf?src-supplier=Element14; ComponentLink3URL: https://datasheet.ciiva.com/46376/1480003-46376301.pdf?src-supplier=Element14; ComponentLink3Description: https://datasheet.ciiva.com/46376/1480003-46376301.pdf?src-supplier=Element14; ComponentLink4URL: https://datasheet.ciiva.com/28418/1790599-28418789.pdf?src-supplier=Element14; ComponentLink4Description: https://datasheet.ciiva.com/28418/1790599-28418789.pdf?src-supplier=Element14; ComponentLink5URL: https://datasheet.ciiva.com/28637/1790599-28637001.pdf?src-supplier=Element14; ComponentLink5Description: https://datasheet.ciiva.com/28637/1790599-28637001.pdf?src-supplier=Element14; ComponentLink6URL: https://datasheet.ciiva.com/30258/aoc0000ce1-30258973.pdf?src-supplier=Onlinecomponents.com; ComponentLink6Description: https://datasheet.ciiva.com/30258/aoc0000ce1-30258973.pdf?src-supplier=Onlinecomponents.com; Supplier 2: Digi-Key; Supplier Part Number 2: Y9103CT-ND; Stock 2: 449100; Pricing 2: 1=0.10000, 10=0.07800, 25=0.05400, 50=0.04200, 100=0.03000, 250=0.02340, 500=0.01860, 1000=0.01320 (USD)
R3 = Resistor: Thin Film Resistors - SMD 0805 1/8W 3.3Kohms; Manufacturer: Panasonic; Manufacturer Part Number: ERA-6AEB332V; Tolerance: 0.1%; Power Rating: 125mW; Voltage Rating: 100V; Resistance: 3.3kR; Temperature Coefficient: 25ppm/°C; Value: 47k; Supplier 1: LCSC; Supplier Part Number 1: C445653; RoHS: Yes; Category: Chip SMD Resistors; Stock 1: 1470; Pricing 1: 5=0.10610, 50=0.07780, 150=0.07270, 500=0.06750, 2500=0.06520, 5000=0.06400, 5=0.10130, 50=0.07430, 150=0.06940, 500=0.06440, 2500=0.06220, 5000=0.06110, 5=0.51570, 50=0.37840, 150=0.35320, 500=0.32790, 2500=0.31670, 5000=0.31120, 5=0.47990, 50=0.35210, 150=0.32870, 500=0.30520, 2500=0.29480, 5000=0.28960, 5=0.06440, 50=0.04730, 150=0.04410, 500=0.04100, 2500=0.03960, 5000=0.03890, 5=0.05880, 50=0.04320, 150=0.04030, 500=0.03740, 2500=0.03610, 5000=0.03550, 5=0.58660, 50=0.43040, 150=0.40170, 500=0.37300, 2500=0.36030, 5000=0.35400, 5=7.99890, 50=5.86920, 150=5.47800, 500=5.08690, 2500=4.91300, 5000=4.82710, 5=0.31460, 50=0.23080, 150=0.21540, 500=0.20010, 2500=0.19320, 5000=0.18980, 5=5.97000, 50=4.38040, 150=4.08850, 500=3.79660, 2500=3.66680, 5000=3.60270, 5=0.67830, 50=0.49770, 150=0.46450, 500=0.43140, 2500=0.41660, 5000=0.40930, 5=0.10350, 50=0.07600, 150=0.07090, 500=0.06580, 2500=0.06360, 5000=0.06250, 5=0.07568, 50=0.05553, 150=0.05183, 500=0.04813, 2500=0.04649, 5000=0.04567 (AUD); Mount: Surface Mount; Case/Package: 0805; Number of Pins: 2; Case Code (Metric): 2012; Case Code (Imperial): 0805; Contact Plating: Tin; Min Operating Temperature: -55°C; Max Operating Temperature: 155°C; Packaging: Tape and Reel; Resistor Type: Thin Film,Metal Film; Termination: SMD/SMT; Voltage Rating (DC): 100V; Package Quantity: 1; Number of Terminations: 2; Max Power Dissipation: 125mW; Features: Automotive AEC-Q200; Length: 2mm; Height: 0.5mm; Width: 1.25mm; Depth: 1.25mm; Radiation Hardening: No; REACH SVHC: No SVHC; Military Standard: Not; Lead Free: Lead Free; ComponentLink1URL: https://datasheet.ciiva.com/11812/0900766b80beefcc-11812518.pdf?src-supplier=RSComponents; ComponentLink1Description: https://datasheet.ciiva.com/11812/0900766b80beefcc-11812518.pdf?src-supplier=RSComponents; ComponentLink2URL: https://datasheet.ciiva.com/29184/453184-da-01-en-widerstand-0805-era-29184137.pdf?src-supplier=Conrad; ComponentLink2Description: https://datasheet.ciiva.com/29184/453184-da-01-en-widerstand-0805-era-29184137.pdf?src-supplier=Conrad; ComponentLink3URL: https://datasheet.ciiva.com/16395/aoa0000ce26-16395271.pdf?src-supplier=Future+Electronics; ComponentLink3Description: https://datasheet.ciiva.com/16395/aoa0000ce26-16395271.pdf?src-supplier=Future+Electronics; ComponentLink4URL: https://datasheet.ciiva.com/16758/70068849-16758824.pdf?src-supplier=Allied+Electronics; ComponentLink4Description: https://datasheet.ciiva.com/16758/70068849-16758824.pdf?src-supplier=Allied+Electronics; ComponentLink5URL: https://datasheet.ciiva.com/6138/485442-6138027.pdf?src-supplier=Farnell; ComponentLink5Description: https://datasheet.ciiva.com/6138/485442-6138027.pdf?src-supplier=Farnell; ComponentLink6URL: https://datasheet.ciiva.com/48536/era-eng-tds-48536683.pdf?src-supplier=Distrelec; ComponentLink6Description: https://datasheet.ciiva.com/48536/era-eng-tds-48536683.pdf?src-supplier=Distrelec; ComponentLink7URL: https://datasheet.ciiva.com/22743/485442-22743068.pdf?src-supplier=Element14; ComponentLink7Description: https://datasheet.ciiva.com/22743/485442-22743068.pdf?src-supplier=Element14; ComponentLink8URL: https://datasheet.ciiva.com/43457/485442-43457821.pdf?src-supplier=Farnell; ComponentLink8Description: https://datasheet.ciiva.com/43457/485442-43457821.pdf?src-supplier=Farnell; ComponentLink9URL: https://datasheet.ciiva.com/17213/aoa0000ce26-17213706.pdf?src-supplier=Avnet+Europe; ComponentLink9Description: https://datasheet.ciiva.com/17213/aoa0000ce26-17213706.pdf?src-supplier=Avnet+Europe; ComponentLink10URL: https://datasheet.ciiva.com/43455/485442-43455263.pdf?src-supplier=Farnell; ComponentLink10Description: https://datasheet.ciiva.com/43455/485442-43455263.pdf?src-supplier=Farnell; ComponentLink11URL: https://datasheet.ciiva.com/6138/485442-6138022.pdf?src-supplier=Farnell; ComponentLink11Description: https://datasheet.ciiva.com/6138/485442-6138022.pdf?src-supplier=Farnell; ComponentLink12URL: https://datasheet.ciiva.com/30068/54aoa0000ce26-30068072.pdf?src-supplier=Onlinecomponents.com; ComponentLink12Description: https://datasheet.ciiva.com/30068/54aoa0000ce26-30068072.pdf?src-supplier=Onlinecomponents.com; ComponentLink13URL: https://datasheet.ciiva.com/9196/aoa0000ce26-9196505.pdf?src-supplier=Avnet; ComponentLink13Description: https://datasheet.ciiva.com/9196/aoa0000ce26-9196505.pdf?src-supplier=Avnet; Supplier 2: Digi-Key; Supplier Part Number 2: P3.3KDACT-ND; Stock 2: 68640; Pricing 2: 1=0.31000, 10=0.26200, 100=0.10230, 1000=0.04284, 2500=0.03927 (USD)
R6 = Resistor: Thick Film Resistors - SMD 0805 4.7Kohms 5% AEC-Q200; Manufacturer: Panasonic; Manufacturer Part Number: ERJ-6GEYJ472V; Resistance: 4.7kR; Temperature Coefficient: 200ppm/°C; Power Rating: 125mW; Voltage Rating: 150V; Value: 4.7k; Supplier 1: LCSC; Supplier Part Number 1: C230645; RoHS: Yes; Category: Chip SMD Resistors; Stock 1: 14050; Pricing 1: 50=0.01030, 500=0.00760, 1500=0.00710, 5000=0.00660, 25000=0.00630, 50000=0.00620, 50=0.00980, 500=0.00720, 1500=0.00670, 5000=0.00630, 25000=0.00610, 50000=0.00590, 50=0.05000, 500=0.03670, 1500=0.03430, 5000=0.03190, 25000=0.03080, 50000=0.03030, 50=0.04650, 500=0.03420, 1500=0.03190, 5000=0.02970, 25000=0.02870, 50000=0.02820, 50=0.00620, 500=0.00460, 1500=0.00430, 5000=0.00400, 25000=0.00390, 50000=0.00380, 50=0.00570, 500=0.00420, 1500=0.00390, 5000=0.00360, 25000=0.00350, 50000=0.00350, 50=0.05680, 500=0.04180, 1500=0.03900, 5000=0.03630, 25000=0.03500, 50000=0.03440, 50=0.77490, 500=0.57000, 1500=0.53230, 5000=0.49460, 25000=0.47790, 50000=0.46970, 50=0.03050, 500=0.02240, 1500=0.02090, 5000=0.01950, 25000=0.01880, 50000=0.01850, 50=0.57840, 500=0.42540, 1500=0.39720, 5000=0.36920, 25000=0.35670, 50000=0.35050, 50=0.06570, 500=0.04830, 1500=0.04510, 5000=0.04190, 25000=0.04050, 50000=0.03980, 50=0.01000, 500=0.00740, 1500=0.00690, 5000=0.00640, 25000=0.00620, 50000=0.00610, 50=0.00733, 500=0.00539, 1500=0.00504, 5000=0.00468, 25000=0.00452, 50000=0.00444 (AUD); Mount: Surface Mount; Case/Package: 0805; Case Code (Metric): 2012; Case Code (Imperial): 0805; Contact Plating: Tin; Min Operating Temperature: -55°C; Max Operating Temperature: 155°C; Packaging: Tape and Reel; Tolerance: 5%; Resistor Type: Thick Film; Termination: SMD/SMT; Voltage Rating (DC): 150V; Package Quantity: 5000; Number of Terminations: 2; Max Power Dissipation: 125mW; Length: 2mm; Height: 0.6mm; Width: 0.049inch; Depth: 1.25mm; Radiation Hardening: No; Lead Free: Lead Free; REACH SVHC: No SVHC; Military Standard: Not; ComponentLink1URL: https://datasheet.ciiva.com/11821/0900766b80f806dd-11821672.pdf?src-supplier=RSComponents; ComponentLink1Description: https://datasheet.ciiva.com/11821/0900766b80f806dd-11821672.pdf?src-supplier=RSComponents; ComponentLink2URL: https://datasheet.ciiva.com/17213/aoa0000ce1-17213189.pdf?src-supplier=Avnet+Europe; ComponentLink2Description: https://datasheet.ciiva.com/17213/aoa0000ce1-17213189.pdf?src-supplier=Avnet+Europe; ComponentLink3URL: https://datasheet.ciiva.com/28514/1678796-28514246.pdf?src-supplier=Element14; ComponentLink3Description: https://datasheet.ciiva.com/28514/1678796-28514246.pdf?src-supplier=Element14; ComponentLink4URL: https://datasheet.ciiva.com/16776/70255313-16776715.pdf?src-supplier=Allied+Electronics; ComponentLink4Description: https://datasheet.ciiva.com/16776/70255313-16776715.pdf?src-supplier=Allied+Electronics; ComponentLink5URL: https://datasheet.ciiva.com/16764/70255313-16764748.pdf?src-supplier=Allied+Electronics; ComponentLink5Description: https://datasheet.ciiva.com/16764/70255313-16764748.pdf?src-supplier=Allied+Electronics; ComponentLink6URL: https://datasheet.ciiva.com/30059/4aoa0000ce1-30059052.pdf?src-supplier=Onlinecomponents.com; ComponentLink6Description: https://datasheet.ciiva.com/30059/4aoa0000ce1-30059052.pdf?src-supplier=Onlinecomponents.com; ComponentLink7URL: https://datasheet.ciiva.com/16513/aoa0000ce1-16513816.pdf?src-supplier=Avnet+Asia; ComponentLink7Description: https://datasheet.ciiva.com/16513/aoa0000ce1-16513816.pdf?src-supplier=Avnet+Asia; ComponentLink8URL: https://datasheet.ciiva.com/28683/1678796-28683432.pdf?src-supplier=Element14; ComponentLink8Description: https://datasheet.ciiva.com/28683/1678796-28683432.pdf?src-supplier=Element14; ComponentLink9URL: https://datasheet.ciiva.com/43460/1500035-43460120.pdf?src-supplier=Farnell; ComponentLink9Description: https://datasheet.ciiva.com/43460/1500035-43460120.pdf?src-supplier=Farnell; ComponentLink10URL: https://datasheet.ciiva.com/9117/aoa0000ce1-9117466.pdf?src-supplier=Avnet; ComponentLink10Description: https://datasheet.ciiva.com/9117/aoa0000ce1-9117466.pdf?src-supplier=Avnet; ComponentLink11URL: https://datasheet.ciiva.com/16448/aoa0000ce1-16448973.pdf?src-supplier=Future+Electronics; ComponentLink11Description: https://datasheet.ciiva.com/16448/aoa0000ce1-16448973.pdf?src-supplier=Future+Electronics; ComponentLink12URL: https://datasheet.ciiva.com/46377/1500035-46377629.pdf?src-supplier=Element14; ComponentLink12Description: https://datasheet.ciiva.com/46377/1500035-46377629.pdf?src-supplier=Element14; ComponentLink13URL: https://datasheet.ciiva.com/46389/1500035-46389597.pdf?src-supplier=Element14; ComponentLink13Description: https://datasheet.ciiva.com/46389/1500035-46389597.pdf?src-supplier=Element14; ComponentLink14URL: https://datasheet.ciiva.com/48531/aoa0000ce1-48531982.pdf?src-supplier=Avnet; ComponentLink14Description: https://datasheet.ciiva.com/48531/aoa0000ce1-48531982.pdf?src-supplier=Avnet; Supplier 2: Digi-Key; Supplier Part Number 2: P4.7KACT-ND; Stock 2: 631699; Pricing 2: 1=0.10000, 10=0.04900, 100=0.02010, 1000=0.00901, 2500=0.00782 (USD)